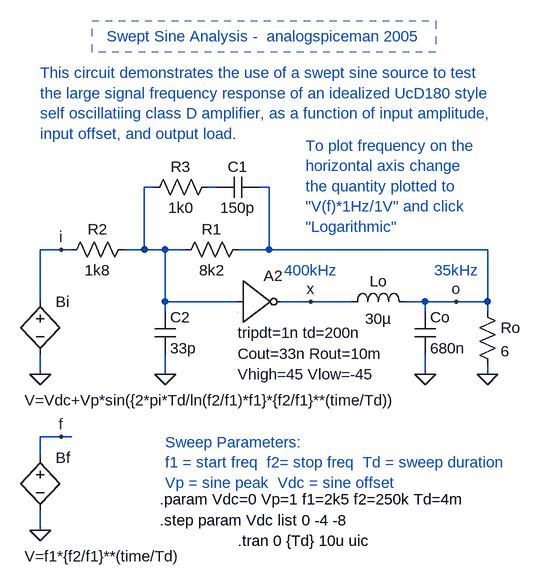
[diagram p0: schematic UcD_swept_sine_test.asc]
UcD_swept_sine_test.asc, the LTspice schematic file:
Version 4
SHEET 1 1324 680
WIRE 64 16 64 -64
WIRE 64 128 64 96
WIRE 64 256 64 224
WIRE 64 368 64 336
WIRE 96 -64 64 -64
WIRE 96 224 64 224
WIRE 112 -64 96 -64
WIRE 112 224 96 224
WIRE 224 -64 192 -64
WIRE 224 -64 224 -160
WIRE 240 -160 224 -160
WIRE 256 -64 224 -64
WIRE 256 16 256 -64
WIRE 256 32 256 16
WIRE 256 128 256 96
WIRE 288 -64 256 -64
WIRE 336 -160 320 -160
WIRE 368 16 256 16
WIRE 416 -160 400 -160
WIRE 416 -64 368 -64
WIRE 416 -64 416 -160
WIRE 480 16 432 16
WIRE 544 16 480 16
WIRE 656 16 624 16
WIRE 656 32 656 16
WIRE 656 128 656 96
WIRE 704 16 656 16
WIRE 752 -64 416 -64
WIRE 752 16 704 16
WIRE 752 16 752 -64
WIRE 752 32 752 16
WIRE 752 128 752 112
FLAG 96 -64 i
FLAG 96 224 f
FLAG 64 368 0
FLAG 64 128 0
FLAG 656 128 0
FLAG 752 128 0
FLAG 480 16 x
FLAG 704 16 o
FLAG 256 128 0
SYMBOL bv 64 240 R0
WINDOW 3 -24 168 Left 0
SYMATTR Value V=f1*{f2/f1}**(time/Td)
SYMATTR InstName Bf
SYMBOL bv 64 0 R0
WINDOW 3 -24 168 Left 0
WINDOW 123 -66 214 Left 0
SYMATTR Value V=Vdc+Vp*sin({2*pi*Td/ln(f2/f1)*f1}*{f2/f1}**(time/Td))
SYMATTR InstName Bi
SYMBOL ind 528 32 R270
WINDOW 0 32 56 VTop 0
WINDOW 3 5 56 VBottom 0
SYMATTR InstName Lo
SYMATTR Value 30µ
SYMATTR SpiceLine Rser=10m Rpar=10k
SYMBOL cap 640 32 R0
SYMATTR InstName Co
SYMATTR Value 680n
SYMBOL res 736 16 R0
SYMATTR InstName Ro
SYMATTR Value 6
SYMBOL res 208 -80 R90
WINDOW 0 0 56 VBottom 0
WINDOW 3 32 56 VTop 0
SYMATTR InstName R2
SYMATTR Value 1k8
SYMBOL res 384 -80 R90
WINDOW 0 0 56 VBottom 0
WINDOW 3 32 56 VTop 0
SYMATTR InstName R1
SYMATTR Value 8k2
SYMBOL res 336 -176 R90
WINDOW 0 0 56 VBottom 0
WINDOW 3 32 56 VTop 0
SYMATTR InstName R3
SYMATTR Value 1k0
SYMBOL cap 400 -176 R90
WINDOW 0 0 32 VBottom 0
WINDOW 3 32 32 VTop 0
SYMATTR InstName C1
SYMATTR Value 150p
SYMBOL cap 240 32 R0
SYMATTR InstName C2
SYMATTR Value 33p
SYMBOL Digital\\inv 368 -48 R0
WINDOW 3 0 112 Left 0
WINDOW 123 0 144 Left 0
WINDOW 39 0 176 Left 0
SYMATTR Value tripdt=1n td=200n
SYMATTR Value2 Cout=33n Rout=10m
SYMATTR SpiceLine Vhigh=45 Vlow=-45
SYMATTR InstName A2
TEXT 368 384 Left 0 !.tran 0 {Td} 10u uic
TEXT 248 320 Left 0 !.param Vdc=0 Vp=1 f1=2k5 f2=250k Td=4m
TEXT 472 -224 Left 0 ;To plot frequency on the\nhorizontal axis change\nthe quantity plotted to\n"V(f)*1Hz/1V" and click\n"Logarithmic"
TEXT 704 -32 Center 0 ;35kHz
TEXT 480 -32 Center 0 ;400kHz
TEXT 64 -336 Left 0 ;This circuit demonstrates the use of a swept sine source to test \nthe large signal frequency response of an idealized UcD180 style \nself oscillatiing class D amplifier, as a function of input amplitude,\ninput offset, and output load.
TEXT 256 232 Left 0 ;Sweep Parameters:\nf1 = start freq  f2= stop freq  Td = sweep duration\nVp = sine peak  Vdc = sine offset
TEXT 408 -392 Center 0 ;Swept Sine Analysis -  analogspiceman 2005
TEXT 248 352 Left 0 !.step param Vdc list 0 -4 -8
RECTANGLE Normal 672 -368 144 -416 1

The netlist it stands for:
* UcD_swept_sine_test.asc
Bf f 0 V=f1*{f2/f1}**(time/Td)
Bi i 0 V=Vdc+Vp*sin({2*pi*Td/ln(f2/f1)*f1}*{f2/f1}**(time/Td))
Lo x o 30µ Rser=10m Rpar=10k
Co o 0 680n
Ro o 0 6
R2 N001 i 1k8
R1 o N001 8k2
R3 N002 N001 1k0
C1 o N002 150p
C2 N001 0 33p
A2 N001 0 0 0 0 x 0 0 BUF tripdt=1n td=200n Cout=33n Rout=10m Vhigh=45 Vlow=-45
.tran 0 {Td} 10u uic
.param Vdc=0 Vp=1 f1=2k5 f2=250k Td=4m
* To plot frequency on the
* horizontal axis change
* the quantity plotted to
* "V(f)*1Hz/1V" and click
* "Logarithmic"
* 35kHz
* 400kHz
* This circuit demonstrates the use of a swept sine source to test
* the large signal frequency response of an idealized UcD180 style
* self oscillatiing class D amplifier, as a function of input amplitude,
* input offset, and output load.
* Sweep Parameters:
* f1 = start freq  f2= stop freq  Td = sweep duration
* Vp = sine peak  Vdc = sine offset
* Swept Sine Analysis -  analogspiceman 2005
.step param Vdc list 0 -4 -8
.backanno
.end